# Altium schematic sheet SCH1.1.SchDoc
size A3
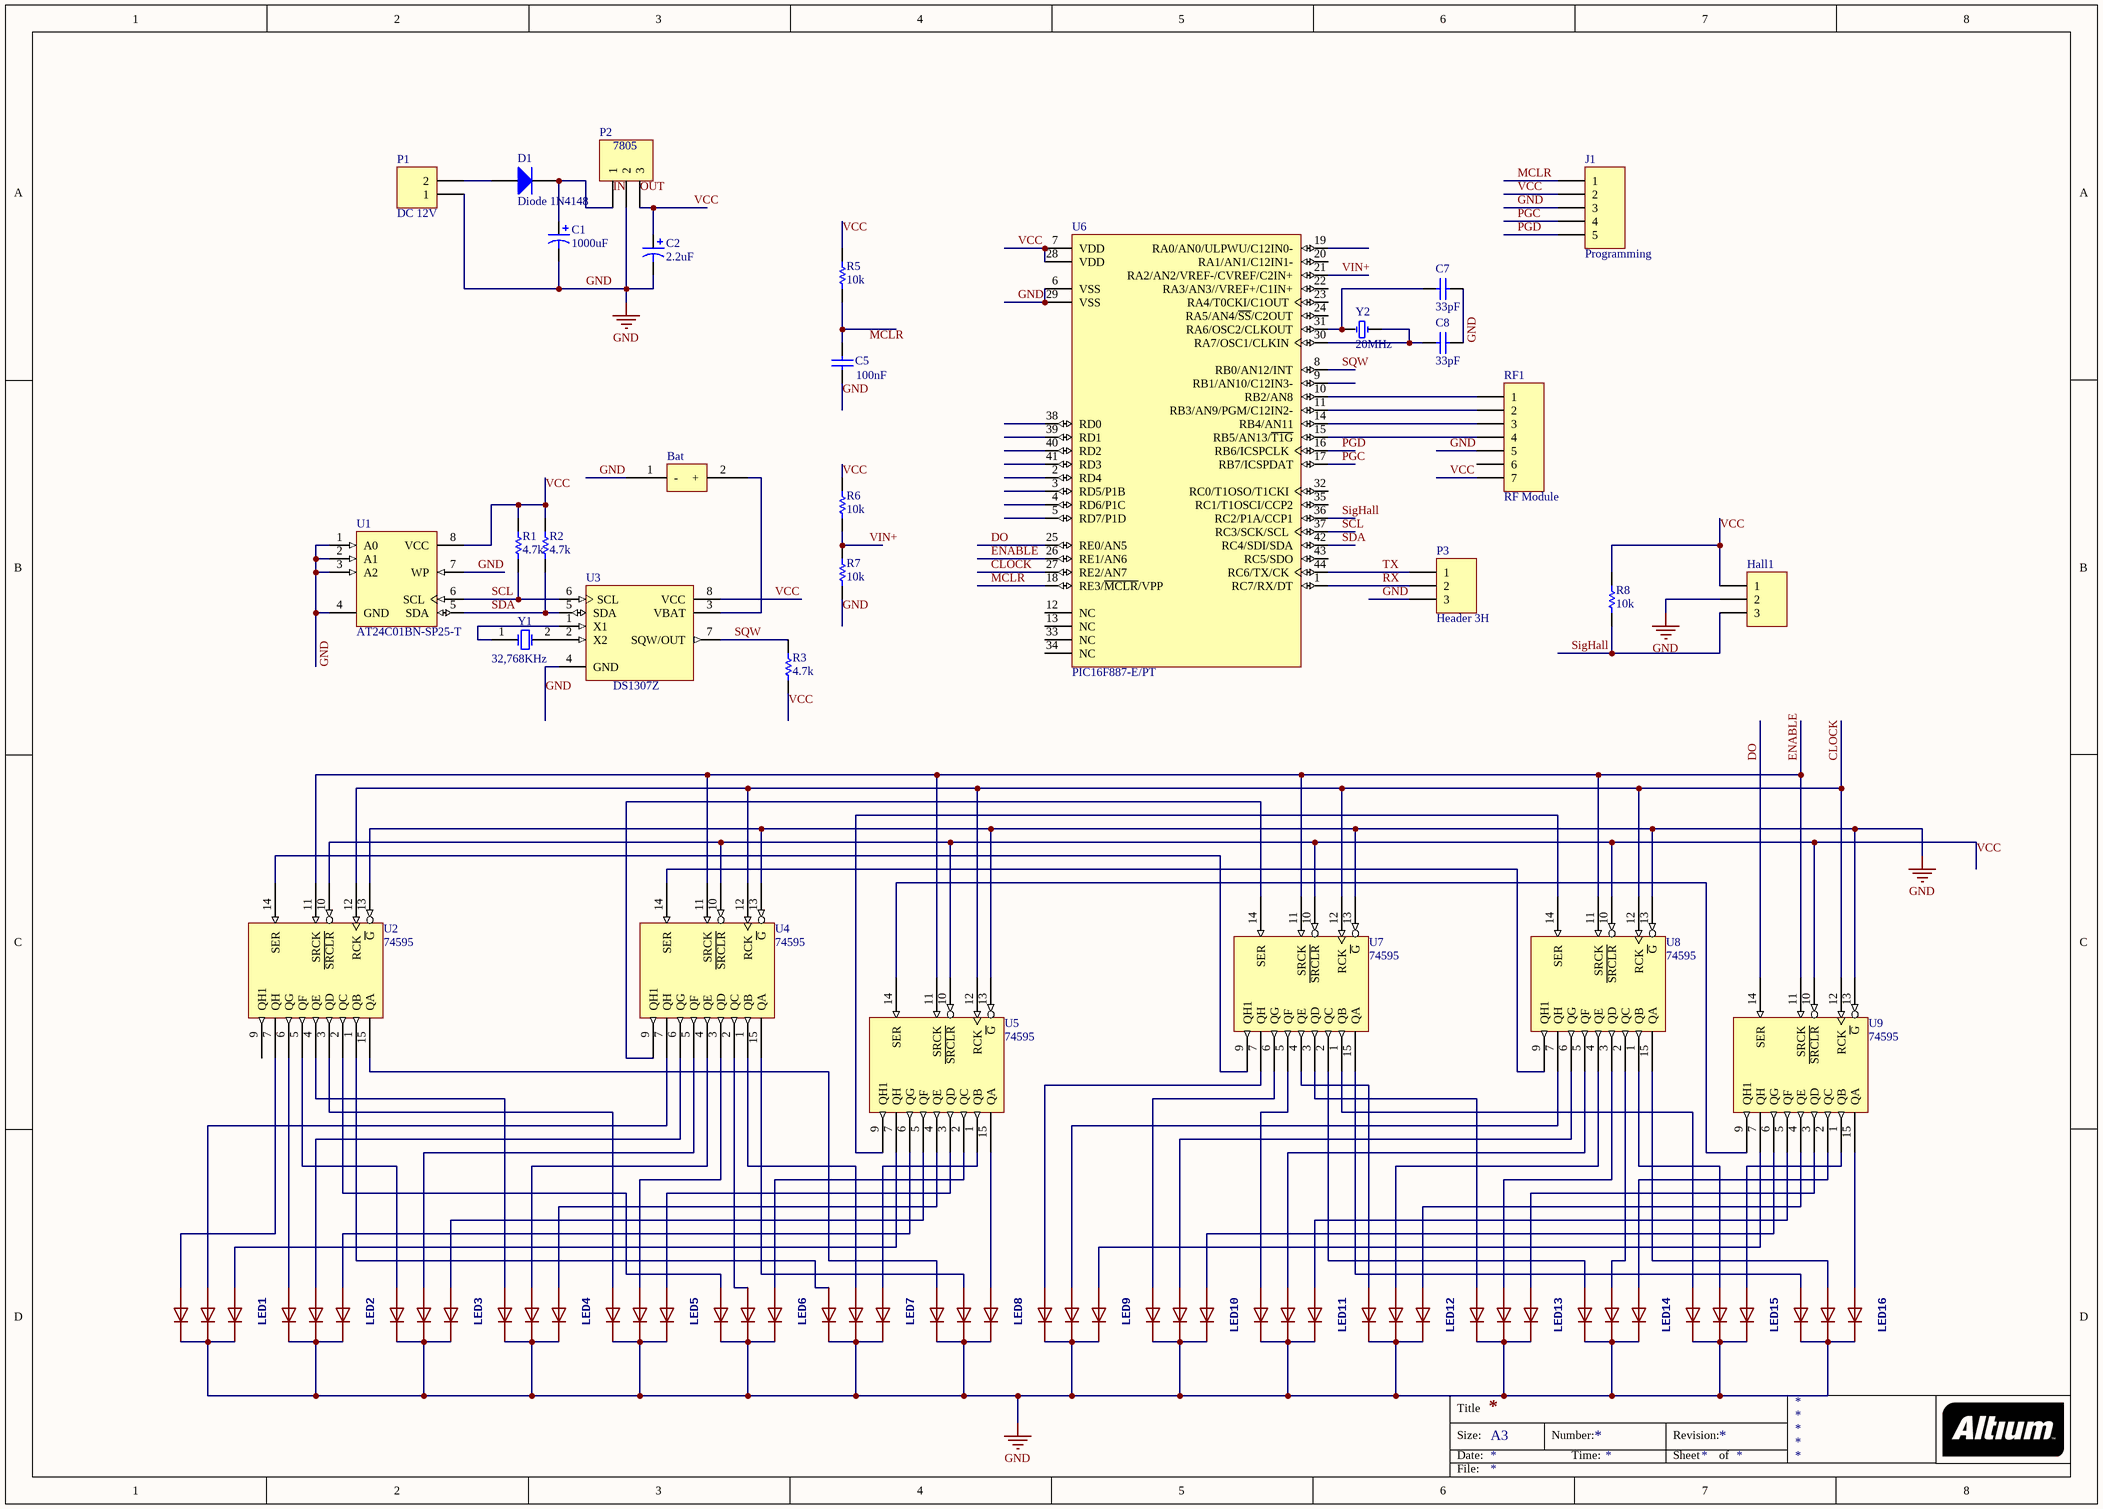
[diagram p0: SCH1.1.SchDoc]

## Parts
Bat  Battery  [BATTERY]  (value not drawn)
C1  value 1000uF  [CAP POL 2]  (hidden comment: Cap Pol3)
C2  value 2.2uF  [CAP POL 2]  (hidden comment: Cap Pol3)
C5  value 100nF  [SM/C_0805]  (hidden comment: Cap Semi)
C7  value 33pF  [SM/C_0805]  (hidden comment: Cap Semi)
C8  value 33pF  [SM/C_0805]  (hidden comment: Cap Semi)
D1  Diode 1N4148  [DO-35]
Hall1  Header 3  [HDR1X3]  (value not drawn)
J1  Programming  [HDR1X5H]
LED1  or 5050 LEDs, the order of the LEDs may vary from one manufacturer to another!  [RGBLED5050]  (value not drawn)
LED2  or 5050 LEDs, the order of the LEDs may vary from one manufacturer to another!  [RGBLED5050]  (value not drawn)
LED3  or 5050 LEDs, the order of the LEDs may vary from one manufacturer to another!  [RGBLED5050]  (value not drawn)
LED4  or 5050 LEDs, the order of the LEDs may vary from one manufacturer to another!  [RGBLED5050]  (value not drawn)
LED5  or 5050 LEDs, the order of the LEDs may vary from one manufacturer to another!  [RGBLED5050]  (value not drawn)
LED6  or 5050 LEDs, the order of the LEDs may vary from one manufacturer to another!  [RGBLED5050]  (value not drawn)
LED7  or 5050 LEDs, the order of the LEDs may vary from one manufacturer to another!  [RGBLED5050]  (value not drawn)
LED8  or 5050 LEDs, the order of the LEDs may vary from one manufacturer to another!  [RGBLED5050]  (value not drawn)
LED9  or 5050 LEDs, the order of the LEDs may vary from one manufacturer to another!  [RGBLED5050]  (value not drawn)
LED10  or 5050 LEDs, the order of the LEDs may vary from one manufacturer to another!  [RGBLED5050]  (value not drawn)
LED11  or 5050 LEDs, the order of the LEDs may vary from one manufacturer to another!  [RGBLED5050]  (value not drawn)
LED12  or 5050 LEDs, the order of the LEDs may vary from one manufacturer to another!  [RGBLED5050]  (value not drawn)
LED13  or 5050 LEDs, the order of the LEDs may vary from one manufacturer to another!  [RGBLED5050]  (value not drawn)
LED14  or 5050 LEDs, the order of the LEDs may vary from one manufacturer to another!  [RGBLED5050]  (value not drawn)
LED15  or 5050 LEDs, the order of the LEDs may vary from one manufacturer to another!  [RGBLED5050]  (value not drawn)
LED16  or 5050 LEDs, the order of the LEDs may vary from one manufacturer to another!  [RGBLED5050]  (value not drawn)
P1  DC 12V  [HDR1X2H]
P2  7805  [HDR1X3]
P3  Header 3H  [HDR1X3H]
R1  value 4.7k  [SM/C_0805]  (hidden comment: Res Semi)
R2  value 4.7k  [SM/C_0805]  (hidden comment: Res Semi)
R3  value 4.7k  [SM/C_0805]  (hidden comment: Res Semi)
R5  value 10k  [SM/C_0805]  (hidden comment: Res Semi)
R6  value 10k  [SM/C_0805]  (hidden comment: Res Semi)
R7  value 10k  [SM/C_0805]  (hidden comment: Res Semi)
R8  value 10k  [SM/C_0805]  (hidden comment: Res Semi)
RF1  RF Module  [HDR1X7]
U1  AT24C01BN-SP25-T  [8S1_N]
U2  74595  [SO16]
U3  DS1307Z  [SOIC8N_N]
U4  74595  [SO16]
U5  74595  [SO16]
U6  PIC16F887-E/PT  [TQFP-PT44_N]
U7  74595  [SO16]
U8  74595  [SO16]
U9  74595  [SO16]
Y1  32,768KHz  [CFPX-93]
Y2  20MHz  [CRYSTAL]

## Nets
GND: Bat.1(-) C1.2 C2.2 C5.1 C7.1 C8.1 Hall1.2 J1.3 LED1.4(BLUE_C) LED1.5(RED_C) LED1.6(GREEN_C) LED2.4(BLUE_C) LED2.5(RED_C) LED2.6(GREEN_C) LED3.4(BLUE_C) LED3.5(RED_C) LED3.6(GREEN_C) LED4.4(BLUE_C) LED4.5(RED_C) LED4.6(GREEN_C) LED5.4(BLUE_C) LED5.5(RED_C) LED5.6(GREEN_C) LED6.4(BLUE_C) LED6.5(RED_C) LED6.6(GREEN_C) LED7.4(BLUE_C) LED7.5(RED_C) LED7.6(GREEN_C) LED8.4(BLUE_C) LED8.5(RED_C) LED8.6(GREEN_C) LED9.4(BLUE_C) LED9.5(RED_C) LED9.6(GREEN_C) LED10.4(BLUE_C) LED10.5(RED_C) LED10.6(GREEN_C) LED11.4(BLUE_C) LED11.5(RED_C) LED11.6(GREEN_C) LED12.4(BLUE_C) LED12.5(RED_C) LED12.6(GREEN_C) LED13.4(BLUE_C) LED13.5(RED_C) LED13.6(GREEN_C) LED14.4(BLUE_C) LED14.5(RED_C) LED14.6(GREEN_C) LED15.4(BLUE_C) LED15.5(RED_C) LED15.6(GREEN_C) LED16.4(BLUE_C) LED16.5(RED_C) LED16.6(GREEN_C) P1.1 P2.2 P3.3 R7.1 RF1.5 U1.1(A0) U1.2(A1) U1.3(A2) U1.4(GND) U1.7(WP) U2.8(GND) U2.13(~{G}) U3.4(GND) U4.8(GND) U4.13(~{G}) U5.8(GND) U5.13(~{G}) U6.6(VSS) U6.29(VSS) U7.8(GND) U7.13(~{G}) U8.8(GND) U8.13(~{G}) U9.8(GND) U9.13(~{G})
VCC: C2.1 Hall1.1 J1.2 P2.3 R1.2 R2.2 R3.1 R5.2 R6.2 R8.2 RF1.7 U1.8(VCC) U2.10(~{SRCLR}) U2.16(VCC) U3.8(VCC) U4.10(~{SRCLR}) U4.16(VCC) U5.10(~{SRCLR}) U5.16(VCC) U6.7(VDD) U6.28(VDD) U7.10(~{SRCLR}) U7.16(VCC) U8.10(~{SRCLR}) U8.16(VCC) U9.10(~{SRCLR}) U9.16(VCC)
CLOCK: U2.12(RCK) U4.12(RCK) U5.12(RCK) U6.27(RE2/AN7) U7.12(RCK) U8.12(RCK) U9.12(RCK)
DO: U6.25(RE0/AN5) U9.14(SER)
ENABLE: U2.11(SRCK) U4.11(SRCK) U5.11(SRCK) U6.26(RE1/AN6) U7.11(SRCK) U8.11(SRCK) U9.11(SRCK)
MCLR: J1.1 U6.18(RE3/~{MCLR}/VPP)
PGC: J1.4 U6.17(RB7/ICSPDAT)
PGD: J1.5 U6.16(RB6/ICSPCLK)
RX: P3.2 U6.1(RC7/RX/DT)
SCL: R1.1 U1.6(SCL) U3.6(SCL) U6.37(RC3/SCK/SCL)
SDA: R2.1 U1.5(SDA) U3.5(SDA) U6.42(RC4/SDI/SDA)
SigHall: Hall1.3 R8.1 U6.36(RC2/P1A/CCP1)
SQW: R3.2 U3.7(SQW/OUT) U6.8(RB0/AN12/INT)
TX: P3.1 U6.44(RC6/TX/CK)
VIN+: R6.1 R7.2 U6.21(RA2/AN2/VREF-/CVREF/C2IN+)
NetBat_2: Bat.2(+) U3.3(VBAT)
NetC1_1: C1.1 D1.2(K) P2.1
NetC5_2: C5.2 R5.1
NetC7_2: C7.2 U6.31(RA6/OSC2/CLKOUT) Y2.1
NetC8_2: C8.2 U6.30(RA7/OSC1/CLKIN) Y2.2
NetD1_1: D1.1(A) P1.2
NetLED1_1: LED1.1(GREEN_A) U4.7(QH)
NetLED1_2: LED1.2(RED_A) U2.7(QH)
NetLED1_3: LED1.3(BLUE_A) U5.7(QH)
NetLED2_1: LED2.1(GREEN_A) U4.6(QG)
NetLED2_2: LED2.2(RED_A) U2.6(QG)
NetLED2_3: LED2.3(BLUE_A) U5.6(QG)
NetLED3_1: LED3.1(GREEN_A) U4.5(QF)
NetLED3_2: LED3.2(RED_A) U2.5(QF)
NetLED3_3: LED3.3(BLUE_A) U5.5(QF)
NetLED4_1: LED4.1(GREEN_A) U4.4(QE)
NetLED4_2: LED4.2(RED_A) U2.4(QE)
NetLED4_3: LED4.3(BLUE_A) U5.4(QE)
NetLED5_1: LED5.1(GREEN_A) U4.3(QD)
NetLED5_2: LED5.2(RED_A) U2.3(QD)
NetLED5_3: LED5.3(BLUE_A) U5.3(QD)
NetLED6_1: LED6.1(GREEN_A) U4.2(QC)
NetLED6_2: LED6.2(RED_A) U2.2(QC)
NetLED6_3: LED6.3(BLUE_A) U5.2(QC)
NetLED7_1: LED7.1(GREEN_A) U4.1(QB)
NetLED7_2: LED7.2(RED_A) U2.1(QB)
NetLED7_3: LED7.3(BLUE_A) U5.1(QB)
NetLED8_1: LED8.1(GREEN_A) U4.15(QA)
NetLED8_2: LED8.2(RED_A) U2.15(QA)
NetLED8_3: LED8.3(BLUE_A) U5.15(QA)
NetLED9_1: LED9.1(GREEN_A) U8.7(QH)
NetLED9_2: LED9.2(RED_A) U7.7(QH)
NetLED9_3: LED9.3(BLUE_A) U9.7(QH)
NetLED10_1: LED10.1(GREEN_A) U8.6(QG)
NetLED10_2: LED10.2(RED_A) U7.6(QG)
NetLED10_3: LED10.3(BLUE_A) U9.6(QG)
NetLED11_1: LED11.1(GREEN_A) U8.5(QF)
NetLED11_2: LED11.2(RED_A) U7.5(QF)
NetLED11_3: LED11.3(BLUE_A) U9.5(QF)
NetLED12_1: LED12.1(GREEN_A) U8.4(QE)
NetLED12_2: LED12.2(RED_A) U7.4(QE)
NetLED12_3: LED12.3(BLUE_A) U9.4(QE)
NetLED13_1: LED13.1(GREEN_A) U8.3(QD)
NetLED13_2: LED13.2(RED_A) U7.3(QD)
NetLED13_3: LED13.3(BLUE_A) U9.3(QD)
NetLED14_1: LED14.1(GREEN_A) U8.2(QC)
NetLED14_2: LED14.2(RED_A) U7.2(QC)
NetLED14_3: LED14.3(BLUE_A) U9.2(QC)
NetLED15_1: LED15.1(GREEN_A) U8.1(QB)
NetLED15_2: LED15.2(RED_A) U7.1(QB)
NetLED15_3: LED15.3(BLUE_A) U9.1(QB)
NetLED16_1: LED16.1(GREEN_A) U8.15(QA)
NetLED16_2: LED16.2(RED_A) U7.15(QA)
NetLED16_3: LED16.3(BLUE_A) U9.15(QA)
NetRF1_1: RF1.1 U6.10(RB2/AN8)
NetRF1_2: RF1.2 U6.11(RB3/AN9/PGM/C12IN2-)
NetRF1_3: RF1.3 U6.14(RB4/AN11)
NetRF1_4: RF1.4 U6.15(RB5/AN13/~{T1G})
NetU2_14: U2.14(SER) U7.9(QH1)
NetU3_1: U3.1(X1) Y1.1(OSC1)
NetU3_2: U3.2(X2) Y1.2(OSC2)
NetU4_9: U4.9(QH1) U7.14(SER)
NetU4_14: U4.14(SER) U8.9(QH1)
NetU5_9: U5.9(QH1) U8.14(SER)
NetU5_14: U5.14(SER) U9.9(QH1)

Not connected (* = marked no-connect by the designer): RF1 6; U2 9(QH1); U6 2(RD4) 3(RD5/P1B) 4(RD6/P1C) 5(RD7/P1D) 9(RB1/AN10/C12IN3-) 12(NC) 13(NC) 19(RA0/AN0/ULPWU/C12IN0-) 20(RA1/AN1/C12IN1-) 22(RA3/AN3//VREF+/C1IN+) 23(RA4/T0CKI/C1OUT) 24(RA5/AN4/~{SS}/C2OUT) 32(RC0/T1OSO/T1CKI) 33(NC) 34(NC) 35(RC1/T1OSCI/CCP2) 38(RD0) 39(RD1) 40(RD2) 41(RD3) 43(RC5/SDO)

## Notes on the sheet
- Labels drawn without touching a wire or pin: IN, MCLR, OUT
- Title
- Size:
- Date:
- A3
- Number:
- Time:
- Revision:
- Sheet
- of
- File:

## Library data of the parts
C1 C2 = Cap Pol3: Polarized Capacitor (Surface Mount); Published: 8-Jun-2000; LatestRevisionDate: 29-May-2009; LatestRevisionNote: IPC-7351 Footprint Added.; PackageReference: C0805; Publisher: Altium Limited; PackageDescription: Chip Capacitor
C5 C7 C8 = Cap Semi: Capacitor (Semiconductor SIM Model); Published: 8-Jun-2000; LatestRevisionDate: 29-May-2009; LatestRevisionNote: IPC-7351 Footprint Added.; PackageReference: C1206; Publisher: Altium Limited; PackageDescription: Chip Capacitor
D1 = Diode 1N4148: High Conductance Fast Diode; Published: 8-Jun-2000; LatestRevisionDate: 17-Jul-2002; LatestRevisionNote: Re-released for DXP Platform.; DatasheetVersion: 1997; PackageReference: DO-35; Publisher: Altium Limited; PackageDescription: Diode, Axial; Body 3.8 x 1.9 mm (LxDia. max), Lead Dia. 0.53 mm (max); Code_JEDEC: DO-204-AH; ComponentLink1Description: Manufacturer Link; ComponentLink1URL: http://www.fairchildsemi.com/; ComponentLink2Description: Datasheet; ComponentLink2URL: http://www.fairchildsemi.com/ds/1N%2F1N4148.pdf
Hall1 P2 = Header 3: Header, 3-Pin; LatestRevisionDate: 17-Jul-2002; LatestRevisionNote: Re-released for DXP Platform.; Publisher: Altium Limited
J1 = Header 5H: Header, 5-Pin, Right Angle; LatestRevisionDate: 17-Jul-2002; LatestRevisionNote: Re-released for DXP Platform.; Publisher: Altium Limited
LED1-LED16 = RGBLED5050
P1 = Header 2H: Header, 2-Pin, Right Angle; LatestRevisionDate: 17-Jul-2002; LatestRevisionNote: Re-released for DXP Platform.; Publisher: Altium Limited
P3 = Header 3H: Header, 3-Pin, Right Angle; LatestRevisionDate: 17-Jul-2002; LatestRevisionNote: Re-released for DXP Platform.; Publisher: Altium Limited
R1-R3 R5-R8 = Res Semi: Semiconductor Resistor; Published: 8-Jun-2000; LatestRevisionDate: 17-Jul-2002; LatestRevisionNote: Re-released for DXP Platform.; PackageReference: AXIAL-0.5; Publisher: Altium Limited
RF1 = Header 7: Header, 7-Pin; LatestRevisionDate: 17-Jul-2002; LatestRevisionNote: Re-released for DXP Platform.; Publisher: Altium Limited
U1 = AT24C01BN-SP25-T: 1Kbit (128 x 8), 2-wire Bus Automotive Serial EEPROM with Write Protect, 2.5V, 8-Pin SOIC, Tape & Reel; Published: 20-Sep-2010; DatasheetVersion: 8517C,  Jan-2009; PackageVersion: revC, Mar-2005; PackageReference: 8S1; Publisher: Altium Limited; PackageDescription: 8-Lead (0.150" Wide Body), Plastic Gull Wing Small Outline (JEDEC SOIC); Code_JEDEC: MS-012-AA; Code_IPC: SOIC127P600-8; ComponentLink1Description: Manufacturer Link; ComponentLink1URL: http://www.atmel.com/products/serial/default.asp; ComponentLink2Description: Datasheet; ComponentLink2URL: http://www.atmel.com/dyn/resources/prod_documents/doc8517.pdf; ComponentLink3Description: Atmel.com Home; ComponentLink3URL: http://www.atmel.com
U2 U4 U5 U7-U9 = 74595: 8-BIT SFT REG WIRTH OUTPUT LCH
U3 = DS1307Z: 64 X 8 Serial Real-Time Clock; Published: 13-Oct-2000; LatestRevisionDate: 13-Apr-2006; LatestRevisionNote: IPC-7351 Footprint Added.; DatasheetVersion: 10-Aug-1999; PackageVersion: 1999; PackageReference: SOIC8N; Publisher: Altium Limited; PackageDescription: 8-Pin Small Outline Integrated Circuit 1.27 mm Pitch; Code_IPC: SOIC127P600-8; ComponentLink1Description: Manufacturer Link; ComponentLink1URL: http://www.maxim-ic.com/; ComponentLink2Description: Datasheet; ComponentLink2URL: http://pdfserv.maxim-ic.com/en/ds/DS1307.pdf; ComponentLink3Description: Discontinuation Notice; ComponentLink3URL: http://www.maxim-ic.com/qa/pdfs/non-obsolescence-letter.pdf
U6 = PIC16F887-E/PT: Flash-Based, 8-Bit CMOS Microcontroller with nanoWatt Technology, 8K (x14-Bit words) Program Memory, 624 Bytes Data Memory, 35 I/O pins, 44-Pin TQFP, Standard VDD Range, Extended Temperature; Published: 29-Jan-2009; LatestRevisionDate: 02-Dec-2009; LatestRevisionNote: Updated datasheet to version revF, Apr-2009.; DatasheetVersion: revF, Apr-2009; PackageVersion: revBB, Aug-2009; PackageReference: TQFP-PT44; Publisher: Altium Limited; PackageDescription: 44-Lead Plastic Thin Quad Flatpack (PT) - 10x10x1mm Body, 2.00mm [TQFP]; Supplier 1: Digi-Key; Supplier Part Number 1: PIC16F887-E/PT-ND; Supplier 2: Farnell; Supplier Part Number 2: 1579592; Code_JEDEC: MS-026; ComponentLink1Description: Datasheet; ComponentLink1URL: http://ww1.microchip.com/downloads/en/DeviceDoc/41291F.pdf; ComponentLink2Description: Packaging Specification; ComponentLink2URL: http://www.microchip.com/stellent/groups/techpub_sg/documents/packagingspec/en012702.pdf; ComponentLink3Description: Microchip.com Home; ComponentLink3URL: http://www.microchip.com/
Y1 = CFPX-93: Surface Mount Quartz Crystal; Note: PCB layout complies with manufacturer's recommendation.; Published: 17-Jul-2002; DatasheetDocument: 9-Sep-1999; PackageDocument: 9-Sep-1999; PackageReference: CFPX-93; Publisher: Altium Limited; ComponentLink1Description: Manufacturer Link; ComponentLink1URL: http://www.cmac.com/mt/
Y2 = XTAL